# EAGLE design ard-nano-thermometer-4digit-display (EAGLE 9.6.2)
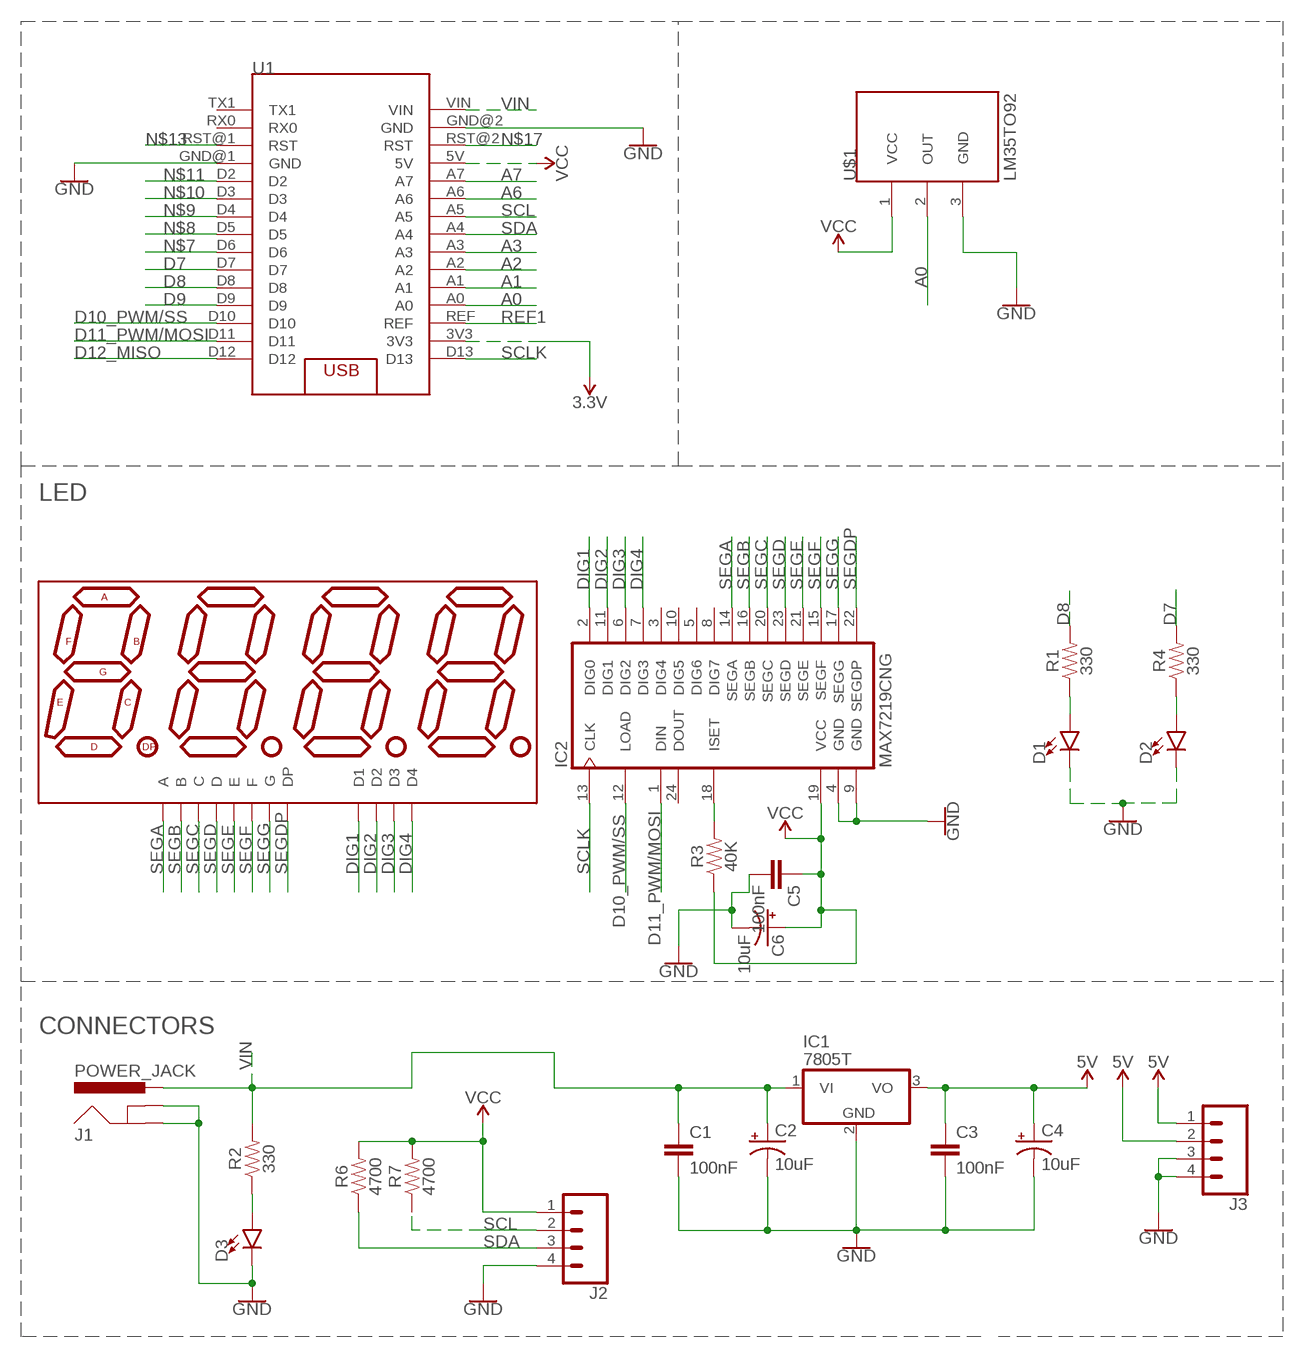
[diagram p0: schematic, sheet 1]

## Parts
C1  100nF  10NF-PTH-10MM-10000V-1-%  [CAP-PTH-10MM]
C2  10uF  10UF-POLAR-RADIAL-2.5MM-25V-20%  [CPOL-RADIAL-2.5MM-5MM]
C3  100nF  10NF-PTH-10MM-10000V-1-%  [CAP-PTH-10MM]
C4  10uF  10UF-POLAR-RADIAL-2.5MM-25V-20%  [CPOL-RADIAL-2.5MM-5MM]
C5  100nF  10NF-PTH-10MM-10000V-1-%  [CAP-PTH-10MM]
C6  10uF  10UF-POLAR-RADIAL-2.5MM-25V-20%  [CPOL-RADIAL-2.5MM-5MM]
D1  LED3MM  [LED_3MM]
D2  LED3MM  [LED_3MM]
D3  LED3MM  [LED_3MM]
DISP1  ATA8041AB  7-SEGMENT-4DIGIT-20MM-BLUE  [7-SEGMENT-4DIGIT-20MM]
IC1  7805T  [TO220H]
IC2  MAX7219CNG  [DIL24-3]
J1  POWER_JACK  [POWER_JACK_PTH]
J2  CONN_04PTH  [1X04]
J3  CONN_04PTH  [1X04]
R1  330  1KOHM-HORIZ-1/4W-5%  [AXIAL-0.3]
R2  330  1KOHM-HORIZ-1/4W-5%  [AXIAL-0.3]
R3  40K  1KOHM-HORIZ-1/4W-1%  [AXIAL-0.3]
R4  330  1KOHM-HORIZ-1/4W-5%  [AXIAL-0.3]
R6  4700  1KOHM-HORIZ-1/4W-1%  [AXIAL-0.3]
R7  4700  1KOHM-HORIZ-1/4W-1%  [AXIAL-0.3]
U1  ARDUINO_NANO  [ARDUINO_NANO]
U$1  LM35TO92  [LM35TO92]

## Nets
3.3V: U1.3V3
5V: C3.1 C4.1(+) IC1.3(VO) J3.1 J3.2
A0: U1.A0 U$1.2(OUT)
A1: U1.A1
A2: U1.A2
A3: U1.A3
A6: U1.A6
A7: U1.A7
D7: R4.P$2 U1.D7
D8: R1.P$2 U1.D8
D9: U1.D9
D10_PWM/SS: IC2.12(LOAD) U1.D10
D11_PWM/MOSI: IC2.1(DIN) U1.D11
D12_MISO: U1.D12
DIG1: DISP1.12(D1) IC2.2(DIG0)
DIG2: DISP1.9(D2) IC2.11(DIG1)
DIG3: DISP1.8(D3) IC2.6(DIG2)
DIG4: DISP1.6(D4) IC2.7(DIG3)
GND: C1.2 C2.2(-) C3.2 C4.2(-) C5.2 C6.2(-) D1.K(C) D2.K(C) D3.K(C) IC1.2(GND) IC2.4(GND) IC2.9(GND) J1.GND J1.GNDBREAK J2.4 J3.3 J3.4 U1.GND@1(GND) U1.GND@2(GND) U$1.3(GND)
N$2: D3.A R2.P$1
N$3: D1.A R1.P$1
N$4: D2.A R4.P$1
N$7: U1.D6
N$8: U1.D5
N$9: U1.D4
N$10: U1.D3
N$11: U1.D2
N$13: U1.RST@1(RST)
N$17: U1.RST@2(RST)
N$28: IC2.18(ISET) R3.P$2
REF1: U1.REF
SCL: J2.2 R7.P$1 U1.A5
SCLK: IC2.13(CLK) U1.D13
SDA: J2.3 R6.P$1 U1.A4
SEGA: DISP1.11(A) IC2.14(SEGA)
SEGB: DISP1.7(B) IC2.16(SEGB)
SEGC: DISP1.4(C) IC2.20(SEGC)
SEGD: DISP1.2(D) IC2.23(SEGD)
SEGDP: DISP1.3(DP) IC2.22(SEGDP)
SEGE: DISP1.1(E) IC2.21(SEGE)
SEGF: DISP1.10(F) IC2.15(SEGF)
SEGG: DISP1.5(G) IC2.17(SEGG)
VCC: C5.1 C6.1(+) IC2.19(VCC) J2.1 R3.P$1 R6.P$2 R7.P$2 U1.5V U$1.1(VCC)
VIN: C1.1 C2.1(+) IC1.1(VI) J1.PWR R2.P$2 U1.VIN
Unconnected: IC2.3(DIG4) IC2.5(DIG6) IC2.8(DIG7) IC2.10(DIG5) IC2.24(DOUT) U1.RX0 U1.TX1

## Notes on the sheet
- LED
- CONNECTORS

## Library data of the parts
C1 C3 C5 = SparkFun-Capacitors:10NF: 0.01uF/10nF/10,000pF ceramic capacitors A capacitor is a passive two-terminal electrical component used to store electrical energy temporarily in an electric field. CAP-09321; PROD_ID: CAP-09321; VALUE: 10nF
C2 C4 C6 = SparkFun-Capacitors:10UF-POLAR: 10.0µF polarized capacitors A capacitor is a passive two-terminal electrical component used to store electrical energy temporarily in an electric field.; PROD_ID: CAP-08440
D1-D3 = SparkFun-LED:LED: LED (Generic) Standard schematic elements and footprints for 5mm, 3mm, 1206, and 0603 sized LEDs. Generic LEDs with no color specified.; PROD_ID: DIO-08794
DISP1 = SparkFun-LED:7-SEGMENT-4DIGIT-20MM: 4 Digit 7 Segment Display This is a part for the 4-Digit 7-segment LEDs from Young Sun. Different from the Digikey LEDs, all 16 pins are used. The LONGPADS Variant is used for a test jig, but you may like it because there is more pad to solder to. If you are concerned about routing space, the standard works just fine though. Datasheets: Red <http://cdn.sparkfun.com/datasheets/Components/LED/1LEDREDCC.pdf> Yellow <http://cdn.sparkfun.com/datasheets/Components/LED/1LEDYELCC.pdf> Green <http://cdn.sparkfun.com/datasheets/Components/LED/1LEDGRNCC.pdf> Blue <http://cdn.sparkfun.com/datasheets/Components/LED/1LEDBLUCC.pdf> White <http://cdn.sparkfun.com/datasheets/Components/LED/1LEDWHTCC.pdf> SparkFun Products Raw Components 7-Segment Display - 20mm (Red) <https://www.sparkfun.com/products/11405> (COM-11405) 7-Segment Display - 20mm (Yellow) <https://www.sparkfun.com/products/11406> (COM-11406) 7-Segment Display - 20mm (Green) <https://www.sparkfun.com/products/11407> (COM-11407) 7-Segment Display - 20mm (Blue) <https://www.sparkfun.com/products/11408> (COM-11408) 7-Segment Display - 20mm (White) <https://www.sparkfun.com/products/11409> (COM-11409) Serial Controlled SparkFun OpenSegment Serial Display - 20mm (Red) <https://www.sparkfun.com/products/11644> (COM-11644) SparkFun OpenSegment Serial Display - 20mm (Yellow) <https://www.sparkfun.com/products/11645> (COM-11645) SparkFun OpenSegment Serial Display - 20mm (Green) <https://www.sparkfun.com/products/11646> (COM-11646) SparkFun OpenSegment Serial Display - 20mm (Blue) <https://www.sparkfun.com/products/11647> (COM-11647) SparkFun OpenSegment Serial Display - 20mm (White) <https://www.sparkfun.com/products/11648> (COM-11648) Other SparkFun OpenSegment Shield <https://www.sparkfun.com/products/13190> (DEV-13190); PROD_ID: COMP-11446
IC1 = linear:78*: Positive VOLTAGE REGULATOR Source: http://cache.national.com/ds/LM/LM78L05.pdf http://www.fairchildsemi.com/ds/LM/LM7805.pdf
IC2 = maxim:MAX7219CNG: LED DISPLAY DRIVER; MF: MAXIM; MPN: MAX7219CNG; OC_FARNELL: 1523914; OC_NEWARK: 34C4018
J1 = SparkFun-Connectors:POWER_JACK: Power Jack Connector This is the standard 5.5mm barrel jack for power. The PTH is the most common, proven, reliable, footprint. The Slot footprint only works if the mill layer is transmitted to the PCB fab house so be warned. Here are the connectors we sell at SparkFun: DC Barrel Power Jack/Connector <https://www.sparkfun.com/products/119> (PRT-00119) DC Barrel Power Jack/Connector (SMD) <https://www.sparkfun.com/products/12748> (PRT-12748) DC Barrel Jack Adapter - Breadboard Compatible <https://www.sparkfun.com/products/10811> (PRT-10811) It is used on this SparkFun product (and many, many others): SparkFun RedBoard - Programmed with Arduino <https://www.sparkfun.com/products/12757> (DEV-12757) Also, if you need a mating power supply or connector, please check these out: Wall Adapter Power Supply - 9VDC 650mA <https://www.sparkfun.com/products/298> (TOL-00298) DC Barrel Jack Adapter - Male <https://www.sparkfun.com/products/10287> (PRT-10287); PROD_ID: CONN-08197
J2 J3 = SparkFun-Connectors:CONN_04: Multi connection point. Often used as Generic Header-pin footprint for 0.1 inch spaced/style header connections On any of the 0.1 inch spaced packages, you can populate with these: Break Away Headers - Straight <https://www.sparkfun.com/products/116> (PRT-00116) Break Away Male Headers - Right Angle <https://www.sparkfun.com/products/553> (PRT-00553) Female Headers <https://www.sparkfun.com/products/115> (PRT-00115) Break Away Headers - Machine Pin <https://www.sparkfun.com/products/117> (PRT-00117) Break Away Female Headers - Swiss Machine Pin <https://www.sparkfun.com/products/743> (PRT-00743) For SCREWTERMINALS and SPRING TERMINALS visit here: Screw Terimnals on SparkFun.com <https://www.sparkfun.com/search/results?term=Screw+Terminals> (5mm/3.5mm/2.54mm spacing) This device is also useful as a general connection point to wire up your design to another part of your project. Our various solder wires solder well into these plated through hole pads. Hook-Up Wire - Assortment (Stranded, 22 AWG) <https://www.sparkfun.com/products/11375> (PRT-11375) Hook-Up Wire - Assortment (Solid Core, 22 AWG) <https://www.sparkfun.com/products/11367> (PRT-11367) View the entire wire category on our website here <https://www.sparkfun.com/categories/141> Special notes: Molex polarized connector foot print use with SKU : PRT-08231 with associated crimp pins and housings. 1MM SMD Version SKU: PRT-10208; PROD_ID: CONN-09696
R1 R2 R4 = SparkFun-Resistors:1KOHM: 1kΩ resistor A resistor is a passive two-terminal electrical component that implements electrical resistance as a circuit element. Resistors act to reduce current flow, and, at the same time, act to lower voltage levels within circuits. - Wikipedia; PROD_ID: RES-08380; VALUE: 1k
R3 R6 R7 = SparkFun-Resistors:1KOHM: 1kΩ resistor A resistor is a passive two-terminal electrical component that implements electrical resistance as a circuit element. Resistors act to reduce current flow, and, at the same time, act to lower voltage levels within circuits. - Wikipedia; PROD_ID: RES-12182; VALUE: 1k
U1 = LRTlib:ARDUINO_NANO: Arduino Nano Device
U$1 = LRTlib:LM35TO92

## Board
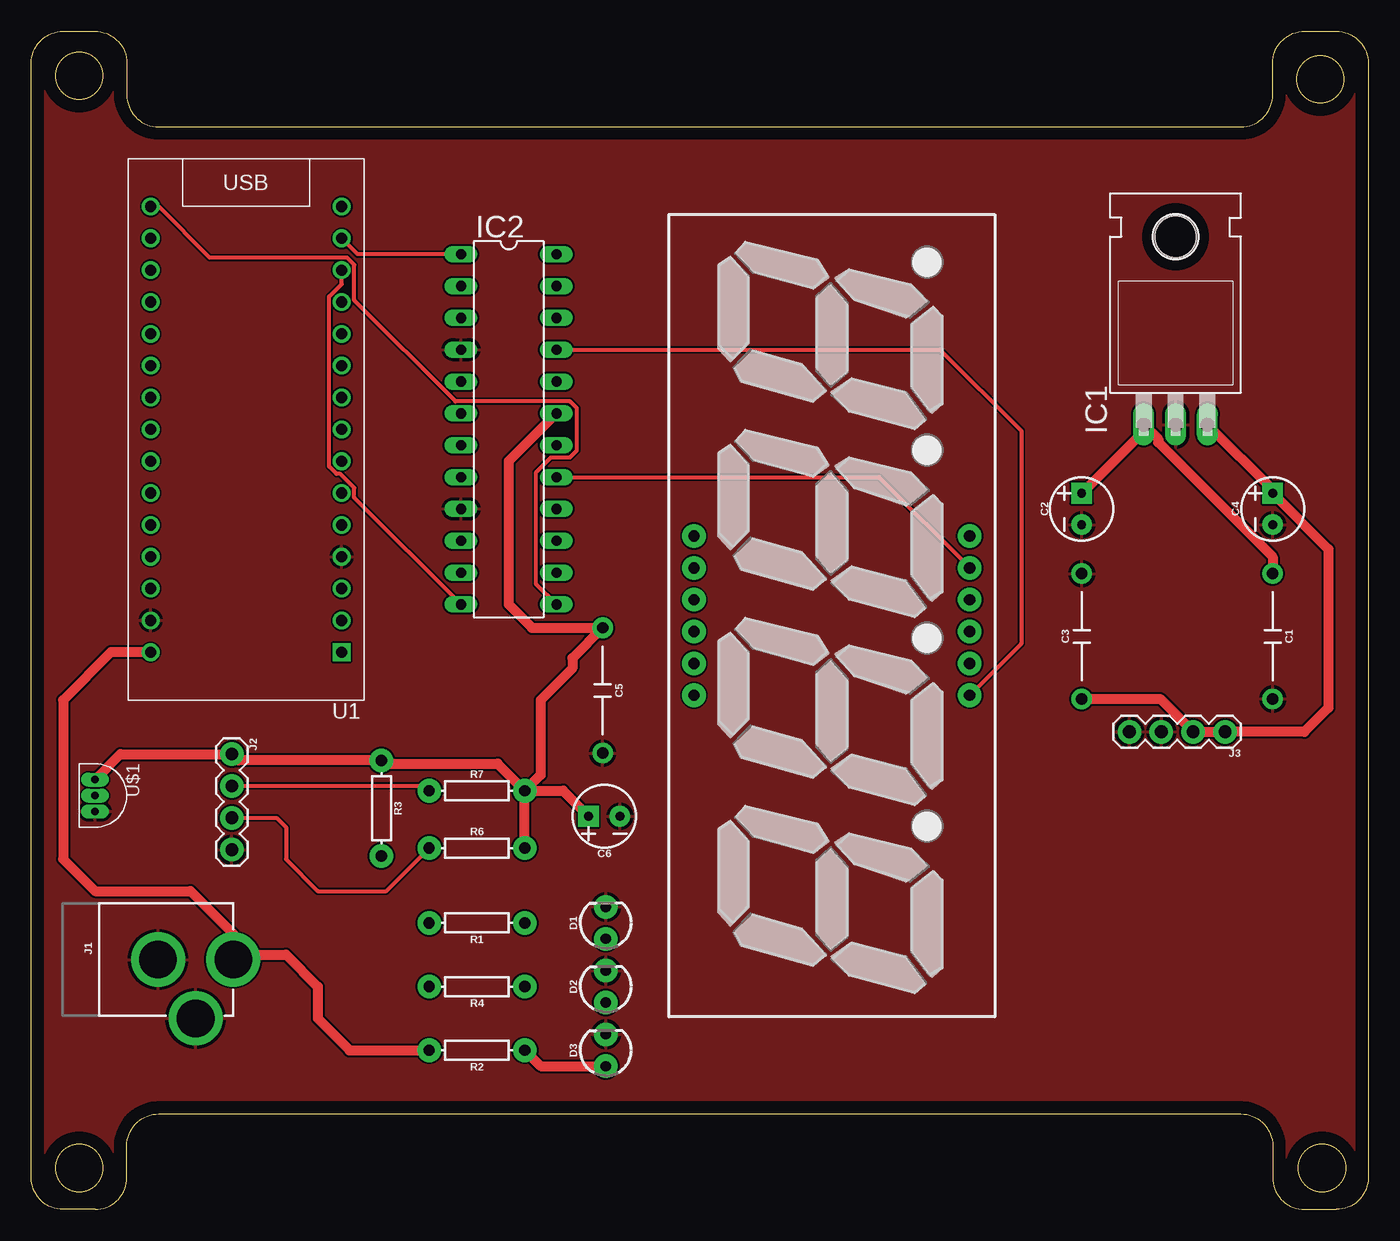
[diagram p1: board, top side]
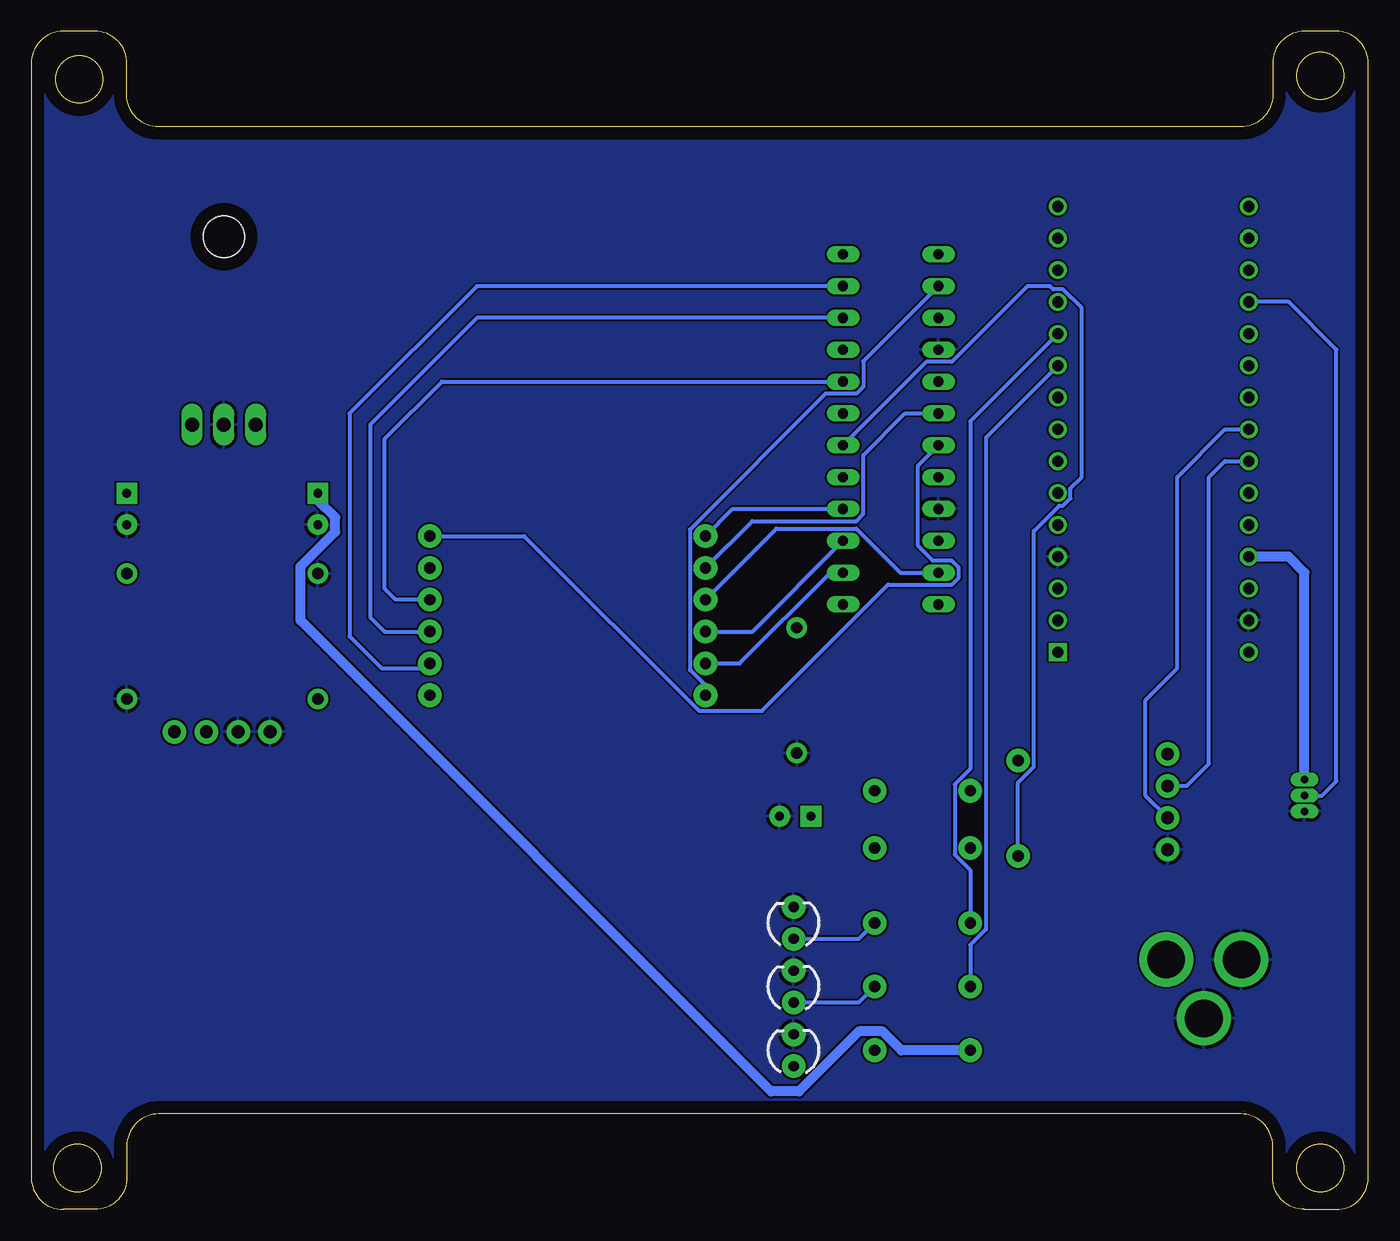
[diagram p2: board, bottom side, seen from below]

Size 106.68 x 93.98 mm. Coordinates in mm from the lower left corner, seen from the top.
Outline: 5.08,0 2.54,0 arc-90 0,2.54 0,91.44 arc-90 2.54,93.98 5.08,93.98 arc-90 7.62,91.44 7.62,88.9 arc90 10.16,86.36 96.52,86.36 arc90 99.06,88.9 99.06,90.17 99.06,91.44 arc-90 101.6,93.98 102.87,93.98 104.14,93.98 arc-90 106.68,91.44 106.68,90.17 106.68,2.54 arc-90 104.14,0 101.6,0 arc-90 99.06,2.54 99.06,5.08 arc90 96.52,7.62 10.16,7.62 arc90 7.62,5.08 7.62,2.54 arc-90 5.08,0
Outline: circle at 102.87,90.17 radius 1.89
Outline: circle at 3.81,90.42 radius 1.89
Outline: circle at 3.81,3.3 radius 1.89
Outline: circle at 103,3.3 radius 1.89
Copper layers (1*16): Top 0.035mm / dielectric 1.5mm / Bottom 0.035mm
Design rules "default": minimum track width 6mil, minimum drill 0.35mm, track to track 6mil, track to pad 6mil, pad to pad 6mil, via to via 6mil, smd to smd 6mil, copper to edge 40mil, drill to drill 6mil, minimum pad ring 10mil, minimum via ring 8mil, stop-mask expansion 4mil, vias tented up to drill 0mil, thermal gap 10mil

### Footprints (pad centres in the part's own frame; a part is rotated, then mirrored left to right if it is on the bottom)
CAP-PTH-10MM = drill 0.9 pad 1.651: 1 -5,0; 2 5,0
CPOL-RADIAL-2.5MM-5MM = drill 0.7 pad 1.651 square: 1 1.25,0 | drill 0.7 pad 1.651: 2 -1.25,0
LED_3MM = drill 0.813 pad 1.88: A -1.27,0; K 1.27,0
7-SEGMENT-4DIGIT-20MM = drill 0.9 pad 1.88: 1 -6.35,-10.998; 2 -3.81,-10.998; 3 -1.27,-10.998; 4 1.27,-10.998; 5 3.81,-10.998; 6 6.35,-10.998; 7 6.35,10.998; 8 3.81,10.998; 9 1.27,10.998; 10 -1.27,10.998; 11 -3.81,10.998; 12 -6.35,10.998
TO220H = drill 1.118 long: 1 -2.54,-10.16; 2 0,-10.16; 3 2.54,-10.16 | hole 3.302: 0,4.826
DIL24-3 = drill 0.813 long: 1 -13.97,-3.81; 2 -11.43,-3.81; 3 -8.89,-3.81; 4 -6.35,-3.81; 5 -3.81,-3.81; 6 -1.27,-3.81; 7 1.27,-3.81; 8 3.81,-3.81; 9 6.35,-3.81; 10 8.89,-3.81; 11 11.43,-3.81; 12 13.97,-3.81; 13 13.97,3.81; 14 11.43,3.81; 15 8.89,3.81; 16 6.35,3.81; 17 3.81,3.81; 18 1.27,3.81; 19 -1.27,3.81; 20 -3.81,3.81; 21 -6.35,3.81; 22 -8.89,3.81; 23 -11.43,3.81; 24 -13.97,3.81
POWER_JACK_PTH = drill 2.997 pad 4.318: GND 0,7.7; GNDBREAK 4.7,10.7; PWR 0,13.7
1X04 = drill 1.016 pad 1.88: 1 0,0; 2 2.54,0; 3 5.08,0; 4 7.62,0
AXIAL-0.3 = drill 0.9 pad 1.88: P$1 -3.81,0; P$2 3.81,0
ARDUINO_NANO = drill 0.9: 3V3 7.62,-15.24; 5V 7.62,10.16; A0 7.62,-10.16; A1 7.62,-7.62; A2 7.62,-5.08; A3 7.62,-2.54; A4 7.62,0; A5 7.62,2.54; A6 7.62,5.08; A7 7.62,7.62; D2 -7.62,7.62; D3 -7.62,5.08; D4 -7.62,2.54; D5 -7.62,0; D6 -7.62,-2.54; D7 -7.62,-5.08; D8 -7.62,-7.62; D9 -7.62,-10.16; D10 -7.62,-12.7; D11 -7.62,-15.24; D12 -7.62,-17.78; D13 7.62,-17.78; GND@1 -7.62,10.16; GND@2 7.62,15.24; REF 7.62,-12.7; RST@1 -7.62,12.7; RST@2 7.62,12.7; RX0 -7.62,15.24; VIN 7.62,17.78 | drill 0.9 square: TX1 -7.62,17.78
LM35TO92 = drill 0.6 long: 1 -1.27,0; 2 0,0; 3 1.27,0

### Placement (x,y rotation side)
C1  99.06,45.72 270 top
C2  83.82,55.88 90 top
C3  83.82,45.72 90 top
C4  99.06,55.88 90 top
C5  45.59,41.4 270 top
C6  45.72,31.37 180 top
D1  45.85,22.86 90 top
D2  45.85,17.78 90 top
D3  45.85,12.7 90 top
DISP1  63.88,47.37 90 top
IC1  91.31,72.77 0 top
IC2  38.1,62.23 270 top
J1  2.41,19.94 270 top
J2  16,36.32 270 top
J3  95.25,38.1 180 top
R1  35.56,22.86 180 top
R2  35.56,12.7 180 top
R3  27.94,32 270 top
R4  35.56,17.78 180 top
R6  35.56,28.83 0 top
R7  35.56,33.4 0 top
U1  17.14,62.23 180 top
U$1  5.08,33.02 270 top

### Tracks (layer width: path | path; a pad name or v marks a point on that pad's centre or on a via)
5V
  Top 0.813: IC1.3 99.06,57.4 C4.1 103.5,52.69 103.5,40.01 101.6,38.1 J3.1 J3.2 90.09,40.72 C3.1
A0
  Bottom 0.305: U$1.2 3.68,33.02 2.54,34.16 2.54,68.58 6.35,72.39 U1.A0
D7
  Bottom 0.305: R4.P$2 31.75,21.1 30.5,22.34 30.5,61.57 U1.D7
D8
  Bottom 0.305: U1.D8 31.75,62.86 31.75,35.16 32.99,33.92 32.99,28.31 31.75,27.07 R1.P$2
D10_PWM/SS
  Top 0.305: IC2.12 25.77,56.78 25.77,57.57 24.66,58.68 24.35,58.68 23.76,59.27 23.76,72.81 24.77,73.82 U1.D10
D11_PWM/MOSI
  Top 0.305: IC2.1 26.04,76.2 U1.D11
DIG1
  Bottom 0.305: IC2.2 40.28,67.67 40.28,65.64 40.85,65.08 43.29,65.08 54.13,54.24 54.13,43.05 52.88,41.8 DISP1.12
DIG2
  Bottom 0.305: DISP1.9 47.22,54.3 40.85,54.3 37.34,50.8 IC2.11
DIG3
  Bottom 0.305: IC2.6 36.96,63.5 40.28,60.17 40.28,55.48 40.85,54.91 49.15,54.91 DISP1.8
DIG4
  Bottom 0.305: DISP1.6 67.34,53.72 53.4,39.78 48.37,39.78 38.31,49.84 33.23,49.84 32.66,50.4 32.66,51.2 33.23,51.77 34.74,51.77 35.92,52.94 35.92,59.33 IC2.7
GND
  pour Top: -2.54,99.06 -2.54,-7.62 111.76,-7.62 111.76,101.6 -2.54,101.6
  pour Bottom: -5.08,60.96 -5.08,-7.62 111.76,-7.62 111.76,101.6 -5.08,101.6
N$2
  Top 0.813: R2.P$1 40.64,11.43 D3.A
N$3
  Bottom 0.305: D1.A 40.64,21.59 R1.P$1
N$4
  Bottom 0.305: D2.A 40.64,16.51 R4.P$1
N$28
  Bottom 0.305: R3.P$2 27.94,34.05 26.7,35.3 26.7,54.11 24.66,56.14 24.35,56.14 23.76,56.73 23.76,57.52 22.86,58.42 22.86,71.91 24.35,73.4 25.14,73.4 25.4,73.66 27.18,73.66 33.23,67.61 35.26,67.61 IC2.18
SCL
  Top 0.305: J2.2 31.37,33.78 R7.P$1
  Bottom 0.305: J2.2 14.48,33.78 12.7,35.56 12.7,58.42 11.43,59.69 U1.A5
SCLK
  Top 0.305: U1.D13 10.16,80.01 14.23,75.94 25.18,75.94 25.77,75.35 25.77,72.53 33.84,64.47 42.97,64.47 43.54,63.9 43.54,60.56 42.97,60 41.46,60 40.28,58.82 40.28,49.89 IC2.13
SDA
  Top 0.305: J2.3 19.56,31.24 20.32,30.48 20.32,27.94 22.86,25.4 28.32,25.4 R6.P$1
  Bottom 0.305: J2.3 17.78,33.02 17.78,40.64 15.24,43.18 15.24,58.42 11.43,62.23 U1.A4
SEGA
  Bottom 0.305: IC2.14 42.93,50.8 50.16,43.56 DISP1.11
SEGB
  Bottom 0.305: DISP1.7 50.72,55.88 IC2.16
SEGC
  Bottom 0.305: DISP1.4 77.6,48.64 78.49,49.53 78.49,61.47 73.91,66.04 IC2.20
SEGD
  Bottom 0.305: IC2.23 71.12,73.66 81.28,63.5 81.28,45.72 78.74,43.18 75.26,43.18 DISP1.2
SEGDP
  Bottom 0.305: IC2.22 71.12,71.12 79.63,62.61 79.63,47.24 78.49,46.1 DISP1.3
SEGE
  Top 0.305: DISP1.1 78.99,45.14 78.99,62.1 72.52,68.58 IC2.21
SEGF
  Bottom 0.305: DISP1.10 49.15,46.1 IC2.15
SEGG
  Top 0.305: IC2.17 67.64,58.42 DISP1.5
VCC
  Top 0.813: R6.P$2 R7.P$2 | R7.P$2 40.64,34.67 40.64,40.64 43.18,43.18 43.18,43.99 C5.1 39.96,46.4 38.1,48.26 38.1,59.69 IC2.19 | R7.P$2 42.44,33.4 C6.1 | R7.P$2 37.21,35.56 28.19,35.56 R3.P$1 16.51,35.81 J2.1 7.11,36.32 U$1.1
  Bottom 0.813: U$1.1 5.08,50.8 6.35,52.07 U1.5V
VIN
  Top 0.813: R2.P$2 25.4,12.7 22.86,15.24 22.86,17.78 20.32,20.32 16.49,20.32 J1.PWR 16.11,21.99 12.7,25.4 5.08,25.4 2.54,27.94 2.54,40.64 6.35,44.45 U1.VIN | C1.1 99.06,52.05 89.92,61.19 89.92,61.47 IC1.1 88.77,62.08 C2.1
  Bottom 0.813: R2.P$2 37.25,12.7 38.75,14.2 40.64,14.2 45.41,9.42 47.64,9.42 85.2,46.99 85.2,51.29 83.25,53.25 82.44,54.06 82.44,55.2 83.82,56.59 C2.1